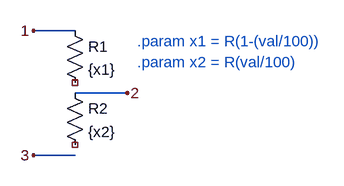
[diagram p0: schematic Draft1.asc]
Draft1.asc, the LTspice schematic file:
Version 4
SHEET 1 880 680
WIRE 160 64 96 64
WIRE 240 160 160 160
WIRE 160 256 96 256
FLAG 96 64 1
FLAG 240 160 2
FLAG 96 256 3
SYMBOL res 144 48 R0
SYMATTR InstName R1
SYMATTR Value {x1}
SYMBOL res 144 144 R0
SYMATTR InstName R2
SYMATTR Value {x2}
TEXT 256 80 Left 2 ;.param x1 = R(1-(val/100))
TEXT 256 112 Left 2 ;.param x2 = R(val/100)

The netlist it stands for:
* Draft1.asc
R1 1 NC_01 {x1}
R2 2 NC_02 {x2}
* .param x1 = R(1-(val/100))
* .param x2 = R(val/100)
.backanno
.end